# Altium schematic sheet UART_ISO.SchDoc
size 209 x 297 mm; Organization: Altium Limited; Address1: L3, 12a Rodborough Rd; Address2: Frenchs Forest; Address3: NSW; Address4: Australia 2086
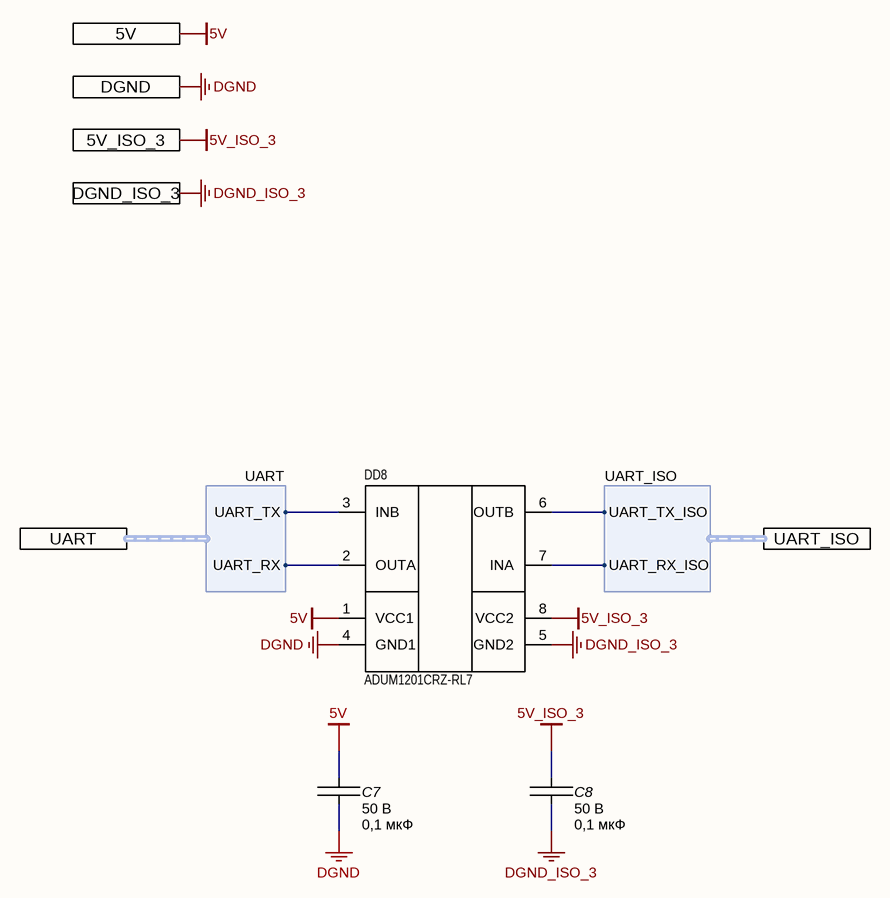
[diagram p0: UART_ISO.SchDoc]

## Parts
C7  Voltage: 50 В  [C0603C]  (hidden comment: 0,1 мкФ)
C8  Voltage: 50 В  [C0603C]  (hidden comment: 0,1 мкФ)
DD8  ADUM1201CRZ-RL7  [SOIC-8]

## Ports
5V, 5V_ISO_3, DGND, DGND_ISO_3, UART (harness UART), UART_ISO (harness UART_ISO)

## Harnesses
UART: UART_TX, UART_RX
UART_ISO: UART_TX_ISO, UART_RX_ISO

## Nets
5V: C7.1 DD8.1(VCC1) ; port 5V
5V_ISO_3: C8.1 DD8.8(VCC2) ; port 5V_ISO_3
DGND: C7.2 DD8.4(GND1) ; port DGND
DGND_ISO_3: C8.2 DD8.5(GND2) ; port DGND_ISO_3
NetDD8_2: DD8.2(OUTA) ; port UART.UART_RX
NetDD8_3: DD8.3(INB) ; port UART.UART_TX
NetDD8_6: DD8.6(OUTB) ; port UART_ISO.UART_TX_ISO
NetDD8_7: DD8.7(INA) ; port UART_ISO.UART_RX_ISO

## Notes on the sheet
- Подп. и дата
- Инв. № дубл.
- Взам. инв. №
- Инв. № подл.
- Изм.
- Лист
- № докум.
- Подп.
- Дата
- Форма 2а ГОСТ 2.104-2006
- Копировал
- Формат А4

## Library data of the parts
C7 C8 = CC0603KRX7R9BB104: SMD 0603 ; X7R; 0,1 мкФ; 50 В; Manufacturer: YAGEO; Persent: ±5%; Type: Ceramic; Part Number: CC0603KRX7R9BB104; Package: SMD 0603; Dielectric: X7R; ComponentLink1Description: Datasheet; Value: 0,1 мкФ
DD8 = ADUM1201CRZ-RL7: Цифровой изолятор 2.5кВ, 2 канала, 1/1